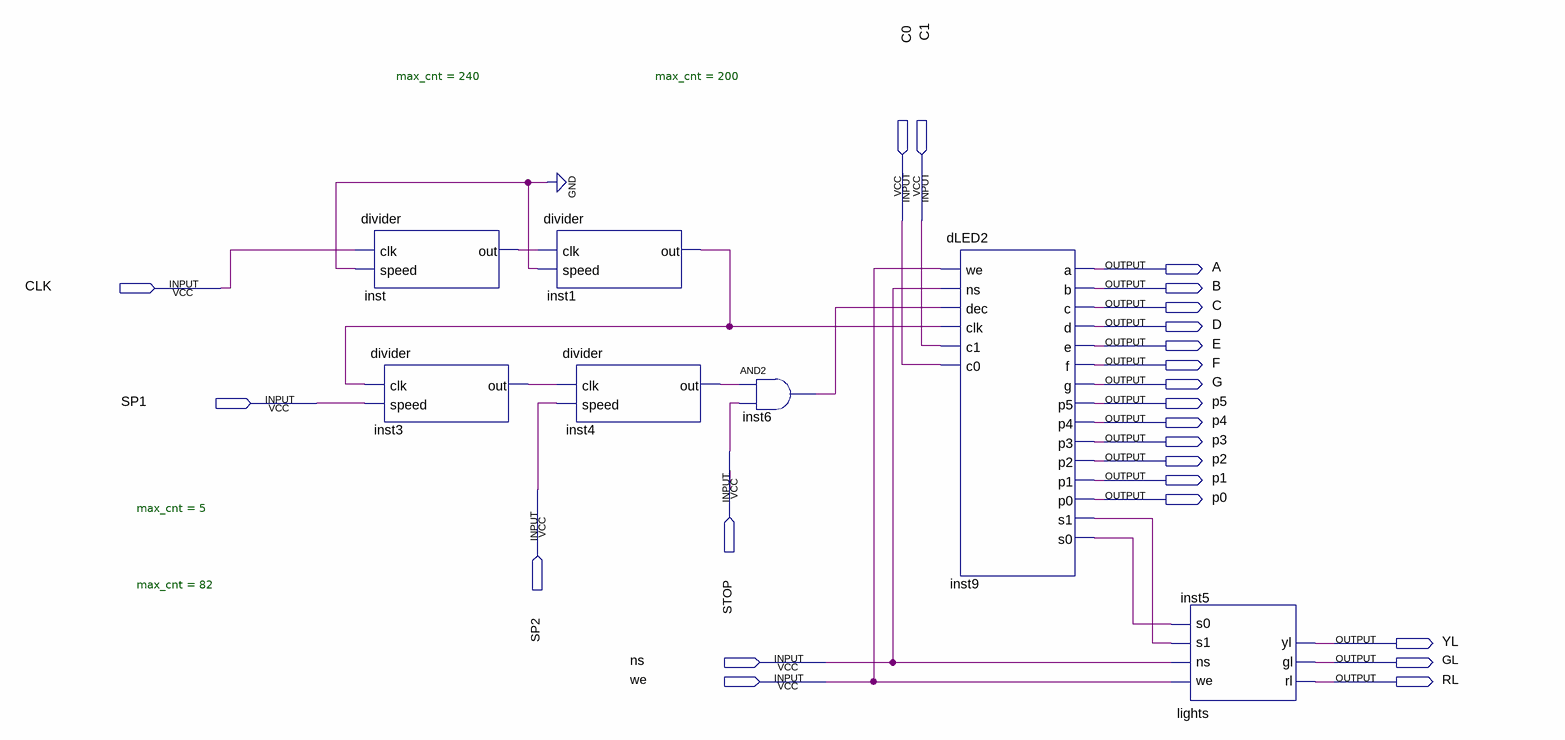
[diagram p0: schematic sheet]
// Quartus schematic ledTest.bdf as structural Verilog: 7 symbols, 24 pins
module ledTest (
  input  C0,
  input  C1,
  input  CLK,
  input  SP1,
  input  STOP,
  input  SP2,
  input  ns,
  input  we,
  output A,
  output B,
  output C,
  output D,
  output E,
  output F,
  output G,
  output p5,
  output p4,
  output p3,
  output p2,
  output p1,
  output p0,
  output YL,
  output GL,
  output RL
);

  wire inst1_out, inst3_out, inst4_out, inst6_out, inst9_s0, inst9_s1, inst_out;

  divider #(.max_cnt(240)) inst (.clk(CLK), .speed(1'b0), .out(inst_out));
  divider #(.max_cnt(5)) inst3 (.clk(inst1_out), .speed(SP1), .out(inst3_out));
  divider #(.max_cnt(200)) inst1 (.clk(inst_out), .speed(1'b0), .out(inst1_out));
  divider #(.max_cnt(82)) inst4 (.clk(inst3_out), .speed(SP2), .out(inst4_out));
  and inst6 (inst6_out, inst4_out, STOP);
  dLED2 inst9 (
    .we(we), .ns(ns), .dec(inst6_out), .clk(inst1_out), .c1(C1), .c0(C0), .a(A), .b(B), .c(C), .d(D), .e(E),
    .f(F), .g(G), .p5(p5), .p4(p4), .p3(p3), .p2(p2), .p1(p1), .p0(p0), .s1(inst9_s1), .s0(inst9_s0));
  lights inst5 (.we(we), .ns(ns), .s1(inst9_s1), .s0(inst9_s0), .rl(RL), .gl(GL), .yl(YL));
endmodule
